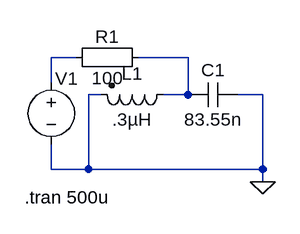
[diagram p0: schematic tank.asc]
tank.asc, the LTspice schematic file:
Version 4
SHEET 1 880 680
WIRE 144 96 112 96
WIRE 288 96 224 96
WIRE 112 128 112 96
WIRE 176 144 160 144
WIRE 288 144 288 96
WIRE 288 144 256 144
WIRE 384 144 352 144
WIRE 112 240 112 208
WIRE 160 240 160 144
WIRE 160 240 112 240
WIRE 384 240 384 144
WIRE 384 240 160 240
WIRE 384 256 384 240
FLAG 384 256 0
SYMBOL voltage 112 112 R0
WINDOW 3 70 -3 Invisible 2
WINDOW 123 0 0 Left 2
WINDOW 39 0 0 Left 2
WINDOW 0 5 11 Left 2
SYMATTR Value SINE(0 12 1Meg 0 0 0)
SYMATTR InstName V1
SYMBOL ind2 272 128 R90
WINDOW 0 4 56 VBottom 2
WINDOW 3 32 56 VTop 2
SYMATTR InstName L1
SYMATTR Value .3µH
SYMATTR Type ind
SYMBOL Misc\\EuropeanCap 352 128 R90
WINDOW 0 0 32 VBottom 2
WINDOW 3 32 32 VTop 2
SYMATTR InstName C1
SYMATTR Value 83.55n
SYMBOL Misc\\EuropeanResistor 128 80 M90
WINDOW 0 5 56 VBottom 2
WINDOW 3 27 56 VTop 2
SYMATTR InstName R1
SYMATTR Value 100
TEXT 78 276 Left 2 !.tran 500u

The netlist it stands for:
* tank.asc
V1 N001 0 SINE(0 12 1Meg 0 0 0)
L1 N002 0 .3µH
C1 0 N002 83.55n
R1 N001 N002 100
.tran 500u
.backanno
.end